# EAGLE design LCD-Panel (EAGLE 6.3)
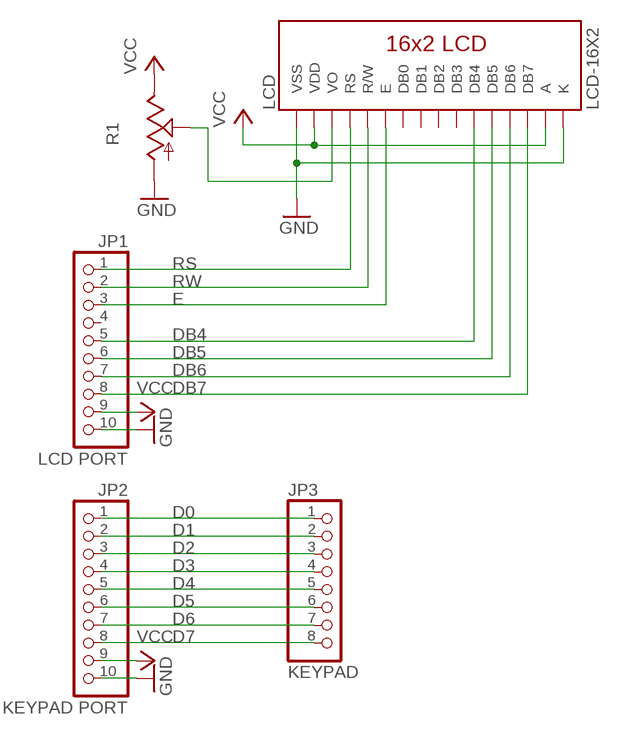
[diagram p0: schematic, sheet 1]

## Parts
JP1  LCD PORT  PINHD-1X10  [1X10]
JP2  KEYPAD PORT  PINHD-1X10  [1X10]
JP3  KEYPAD  PINHD-1X8  [1X08]
LCD  LCD-16X2  [LCD-16X2]
R1  TRIMPOTCA6V  [CA6V]

## Nets
D0: JP2.1 JP3.1
D1: JP2.2 JP3.2
D2: JP2.3 JP3.3
D3: JP2.4 JP3.4
D4: JP2.5 JP3.5
D5: JP2.6 JP3.6
D6: JP2.7 JP3.7
D7: JP2.8 JP3.8
DB4: JP1.5 LCD.11(DB4)
DB5: JP1.6 LCD.12(DB5)
DB6: JP1.7 LCD.13(DB6)
DB7: JP1.8 LCD.14(DB7)
E: JP1.3 LCD.6(E)
GND: JP1.10 JP2.10 LCD.1(VSS) LCD.16(K) R1.A
N$3: LCD.3(VO) R1.S
RS: JP1.1 LCD.4(RS)
RW: JP1.2 LCD.5(R/W)
VCC: JP1.9 JP2.9 LCD.2(VDD) LCD.15(A) R1.E
Unconnected: JP1.4 LCD.7(DB0) LCD.8(DB1) LCD.9(DB2) LCD.10(DB3)

## Library data of the parts
JP1 JP2 = barelang-store:PINHD-1X10: PIN HEADER
JP3 = barelang-store:PINHD-1X8: PIN HEADER
LCD = barelang-store:LCD-16X2
R1 = barelang-store:TRIMPOT: POTENTIOMETER

## Board
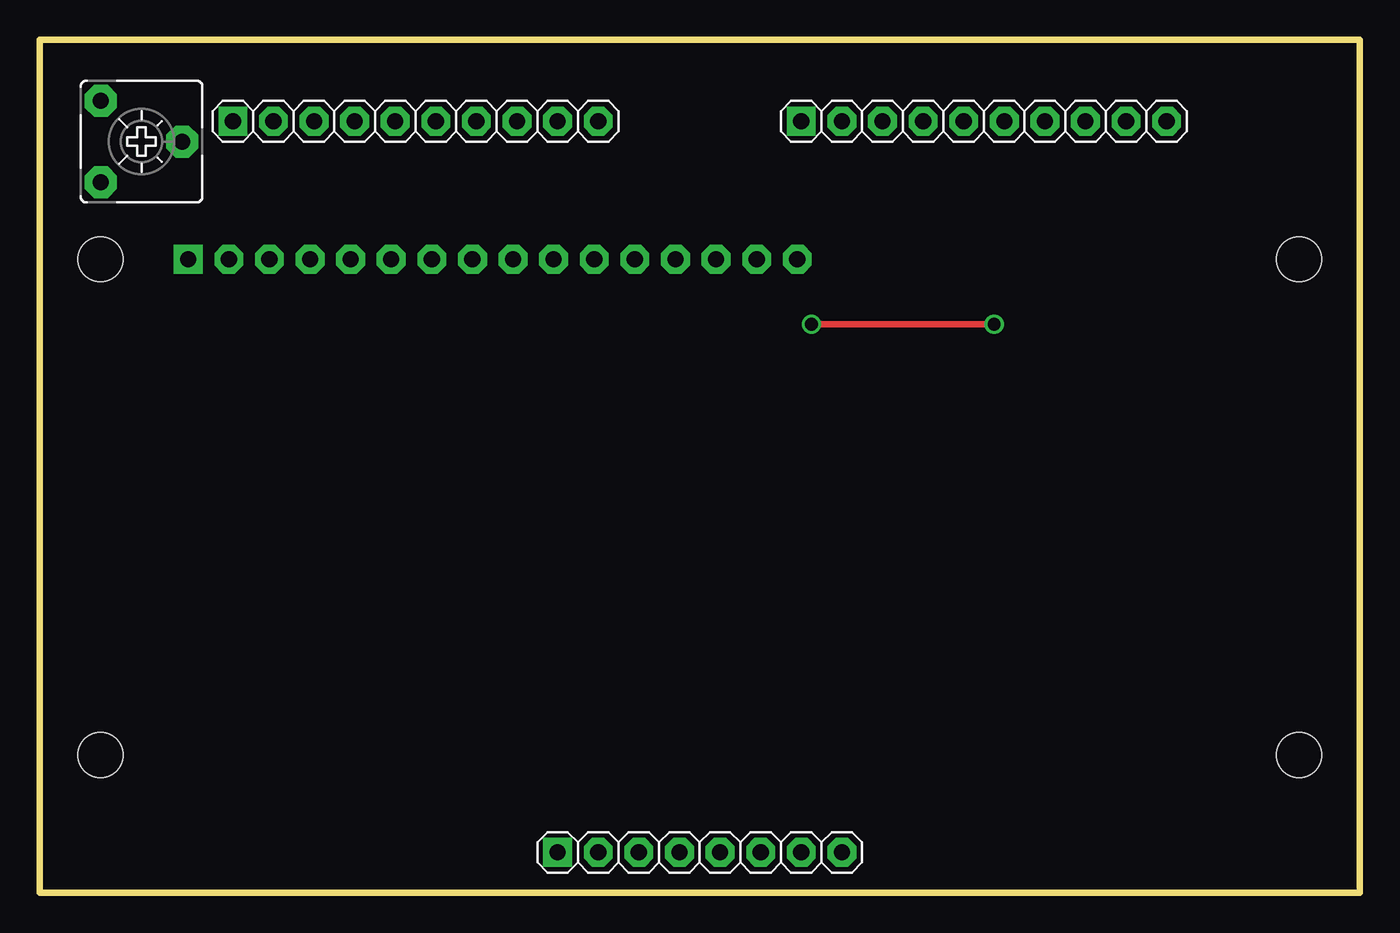
[diagram p1: board, top side]
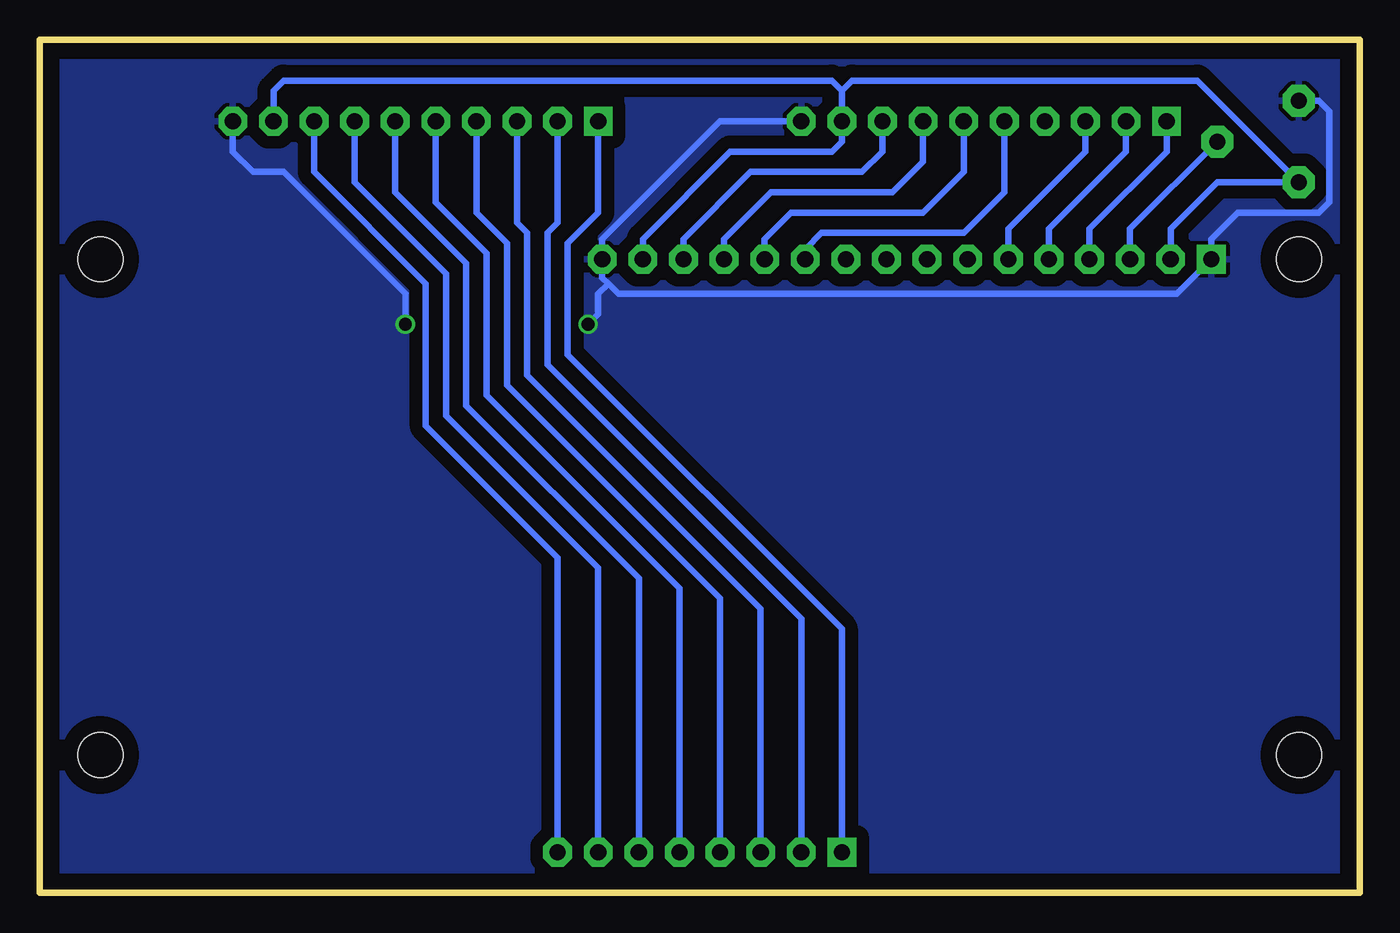
[diagram p2: board, bottom side, seen from below]

Size 82.55 x 53.34 mm. Coordinates in mm from the lower left corner, seen from the top.
Outline: 0,53.34 82.55,53.34 82.55,0 0,0 0,53.34
Copper layers (1*16): Top 0.035mm / dielectric 1.5mm / Bottom 0.035mm
Design rules "default *": minimum track width 0.3mm, minimum drill 0.8mm, track to track 10mil, track to pad 10mil, pad to pad 10mil, via to via 10mil, smd to smd 8mil, copper to edge 40mil, drill to drill 8mil, minimum pad ring 10mil, minimum via ring 8mil, stop-mask expansion 4mil, vias tented up to drill 0mil, thermal gap 10mil

### Footprints (pad centres in the part's own frame; a part is rotated, then mirrored left to right if it is on the bottom)
1X10 = drill 1.016 pad 1.8 square: 1 -11.43,0 | drill 1.016 pad 1.8 octagon: 2 -8.89,0; 3 -6.35,0; 4 -3.81,0; 5 -1.27,0; 6 1.27,0; 7 3.81,0; 8 6.35,0; 9 8.89,0; 10 11.43,0
1X08 = drill 1.016 pad 1.8 square: 1 -8.89,0 | drill 1.016 pad 1.8 octagon: 2 -6.35,0; 3 -3.81,0; 4 -1.27,0; 5 1.27,0; 6 3.81,0; 7 6.35,0; 8 8.89,0
LCD-16X2 = drill 1.016 pad 1.8 square: 1 -32,15.5 | drill 1.016 pad 1.8 octagon: 2 -29.46,15.5; 3 -26.92,15.5; 4 -24.38,15.5; 5 -21.84,15.5; 6 -19.3,15.5; 7 -16.76,15.5; 8 -14.22,15.5; 9 -11.68,15.5; 10 -9.14,15.5; 11 -6.6,15.5; 12 -4.06,15.5; 13 -1.52,15.5; 14 1.02,15.5; 15 3.56,15.5; 16 6.1,15.5 | hole 2.8: -37.5,15.5; -37.5,-15.5; 37.5,15.5; 37.5,-15.5
CA6V = drill 1 pad 2 octagon: A -2.54,-2.54; E 2.54,-2.54; S 0,2.54

### Placement (x,y rotation side)
JP1  23.5,48.26 0 top
JP2  59.05,48.26 0 top
JP3  41.27,2.54 0 top
LCD  41.27,24.13 0 top
R1  6.35,46.99 270 top

### Tracks (layer width: path | path; a pad name or v marks a point on that pad's centre or on a via)
D0
  Bottom 0.4: JP2.1 47.62,42.55 49.53,40.64 49.53,33.66 32.38,16.51 JP3.1
D1
  Bottom 0.4: JP3.2 34.92,17.15 50.8,33.02 50.8,41.28 50.16,41.91 JP2.2
D2
  Bottom 0.4: JP2.3 52.7,41.91 52.07,41.28 52.07,32.38 37.47,17.78 JP3.3
D3
  Bottom 0.4: JP3.4 40.01,18.41 53.34,31.75 53.34,40.64 55.24,42.55 JP2.4
D4
  Bottom 0.4: JP2.5 57.78,43.18 54.61,40.01 54.61,31.12 42.55,19.05 JP3.5
D5
  Bottom 0.4: JP3.6 45.09,19.69 55.88,30.48 55.88,39.37 60.32,43.81 JP2.6
D6
  Bottom 0.4: JP2.7 62.87,44.45 57.15,38.73 57.15,29.84 47.62,20.32 JP3.7
D7
  Bottom 0.4: JP3.8 50.16,20.95 58.42,29.21 58.42,38.1 65.41,45.08 JP2.8
DB4
  Bottom 0.4: JP1.5 22.23,43.81 24.77,41.28 33.66,41.28 34.67,40.26 LCD.11
DB5
  Bottom 0.4: JP1.6 24.77,45.08 27.3,42.55 35.56,42.55 37.22,40.89 LCD.12
DB6
  Bottom 0.4: JP1.7 27.3,45.72 29.21,43.81 36.83,43.81 39.76,40.89 LCD.13
DB7
  Bottom 0.4: JP1.8 29.84,46.36 31.12,45.08 38.1,45.08 42.3,40.89 LCD.14
E
  Bottom 0.4: JP1.3 17.14,46.36 21.98,41.53 LCD.6
GND  (via drill 0.8)
  Top 0.4: v59.69,35.56 v48.26,35.56
  Bottom 0.4: JP1.10 40.01,48.26 47.38,40.89 LCD.16 47.38,38.48 46.99,38.1 | R1.A 2.54,49.53 1.91,48.89 1.91,43.18 2.54,42.55 7.62,42.55 9.28,40.89 LCD.1 11.44,37.47 46.35,37.47 46.99,38.1 | JP2.10 70.48,46.36 69.22,45.08 67.31,45.08 59.69,37.47 v59.69,35.56 | v48.26,35.56 47.62,36.2 47.62,37.47 46.99,38.1
  pour Bottom (isolate 0.8): 0,0 82.55,0 82.55,53.34 0,53.34
N$3
  Bottom 0.4: R1.S 14.36,41.53 LCD.3
RS
  Bottom 0.4: JP1.1 12.07,46.36 16.89,41.53 LCD.4
RW
  Bottom 0.4: JP1.2 14.61,46.36 19.44,41.53 LCD.5
VCC
  Bottom 0.4: LCD.15 44.84,40.89 39.37,46.36 33.02,46.36 32.38,46.99 JP1.9 32.38,50.17 | JP2.9 67.95,50.17 67.31,50.8 33.02,50.8 32.38,50.17 | LCD.2 11.82,41.53 8.89,44.45 R1.E 10.16,50.8 31.75,50.8 32.38,50.17